# Altium schematic sheet OVERVIEW.SchDoc
size A4; SheetNumber: 1; SheetTotal: 5
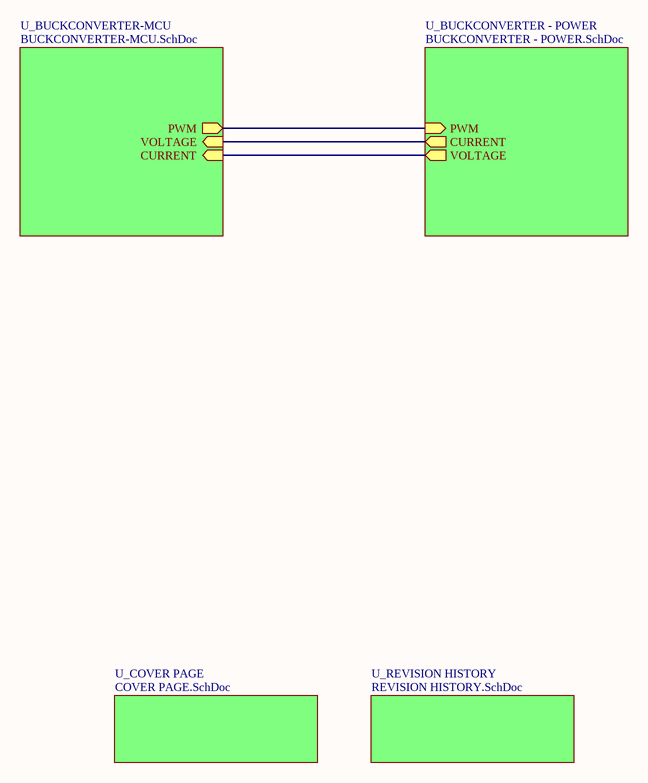
[diagram p0: OVERVIEW.SchDoc]

## Sub-sheets
U_BUCKCONVERTER - POWER = BUCKCONVERTER - POWER.SchDoc: PWM (in), CURRENT (out), VOLTAGE (out)
U_BUCKCONVERTER-MCU = BUCKCONVERTER-MCU.SchDoc: PWM (out), VOLTAGE (in), CURRENT (in)
U_COVER PAGE = COVER PAGE.SchDoc: no entries
U_REVISION HISTORY = REVISION HISTORY.SchDoc: no entries

## Nets
(unnamed): sheet U_BUCKCONVERTER-MCU/PWM, sheet U_BUCKCONVERTER - POWER/PWM
(unnamed): sheet U_BUCKCONVERTER-MCU/VOLTAGE, sheet U_BUCKCONVERTER - POWER/CURRENT
(unnamed): sheet U_BUCKCONVERTER-MCU/CURRENT, sheet U_BUCKCONVERTER - POWER/VOLTAGE